# Altium schematic sheet TPS5450.SchDoc
size A4
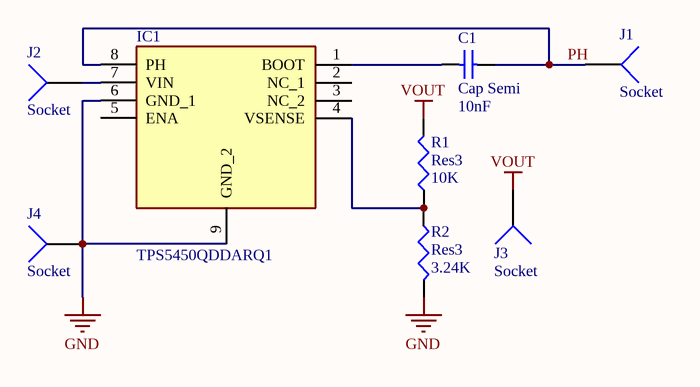
[diagram p0: TPS5450.SchDoc]

## Parts
C1  Cap Semi  value 10nF  [1608[0603]]
IC1  TPS5450QDDARQ1  [SOIC127P600X170-9N]
J1  Socket  [PIN1]
J2  Socket  [PIN1]
J3  Socket  [PIN1]
J4  Socket  [PIN1]
R1  Res3  value 10K  [J1-0603]
R2  Res3  value 3.24K  [J1-0603]

## Nets
GND: IC1.6(GND_1) IC1.9(GND_2) J4.1 R2.2
VOUT: J3.1 R1.2
PH: C1.2 IC1.8(PH) J1.1
NetC1_1: C1.1 IC1.1(BOOT)
NetIC1_4: IC1.4(VSENSE) R1.1 R2.1
NetIC1_7: IC1.7(VIN) J2.1

Not connected (* = marked no-connect by the designer): IC1 2(NC_1) 3(NC_2) 5(ENA)

## Library data of the parts
C1 = Cap Semi: Capacitor (Semiconductor SIM Model); Published: 8-Jun-2000; LatestRevisionDate: 29-May-2009; LatestRevisionNote: IPC-7351 Footprint Added.; PackageReference: C1206; Publisher: Altium Limited; PackageDescription: Chip Capacitor
IC1 = TPS5450QDDARQ1: Integrated Circuit; Manufacturer_Name: Texas Instruments; Datasheet Link: http://www.ti.com/lit/gpn/tps5450-q1; Height: 1.7mm; Manufacturer_Part_Number: TPS5450QDDARQ1; Mouser Part Number: 595-TPS5450QDDARQ1; Mouser Price/Stock: https://www.mouser.com/Search/Refine.aspx?Keyword=595-TPS5450QDDARQ1
R1 R2 = Res3: Resistor; Published: 8-Jun-2000; LatestRevisionDate: 29-May-2009; LatestRevisionNote: IPC-7351 Footprint Added.; PackageReference: J1-0603; Publisher: Altium Limited; PackageDescription: Chip Resistor
J1-J4 = Socket: LatestRevisionDate: 17-Jul-2002; LatestRevisionNote: Re-released for DXP Platform.; Publisher: Altium Limited